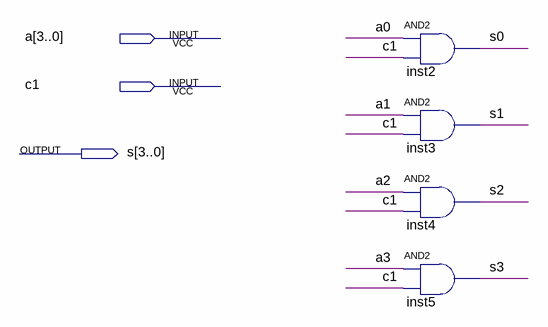
[diagram p0: schematic sheet]
// Quartus schematic mbr_and2_4b.bdf as structural Verilog: 4 symbols, 3 pins
module mbr_and2_4b (
  input  [3:0] a,
  input  c1,
  output [3:0] s
);

  and inst2 (s[0], a[0], c1);
  and inst3 (s[1], a[1], c1);
  and inst4 (s[2], a[2], c1);
  and inst5 (s[3], a[3], c1);
endmodule
